# Altium project PS_WIKA.PrjPcb
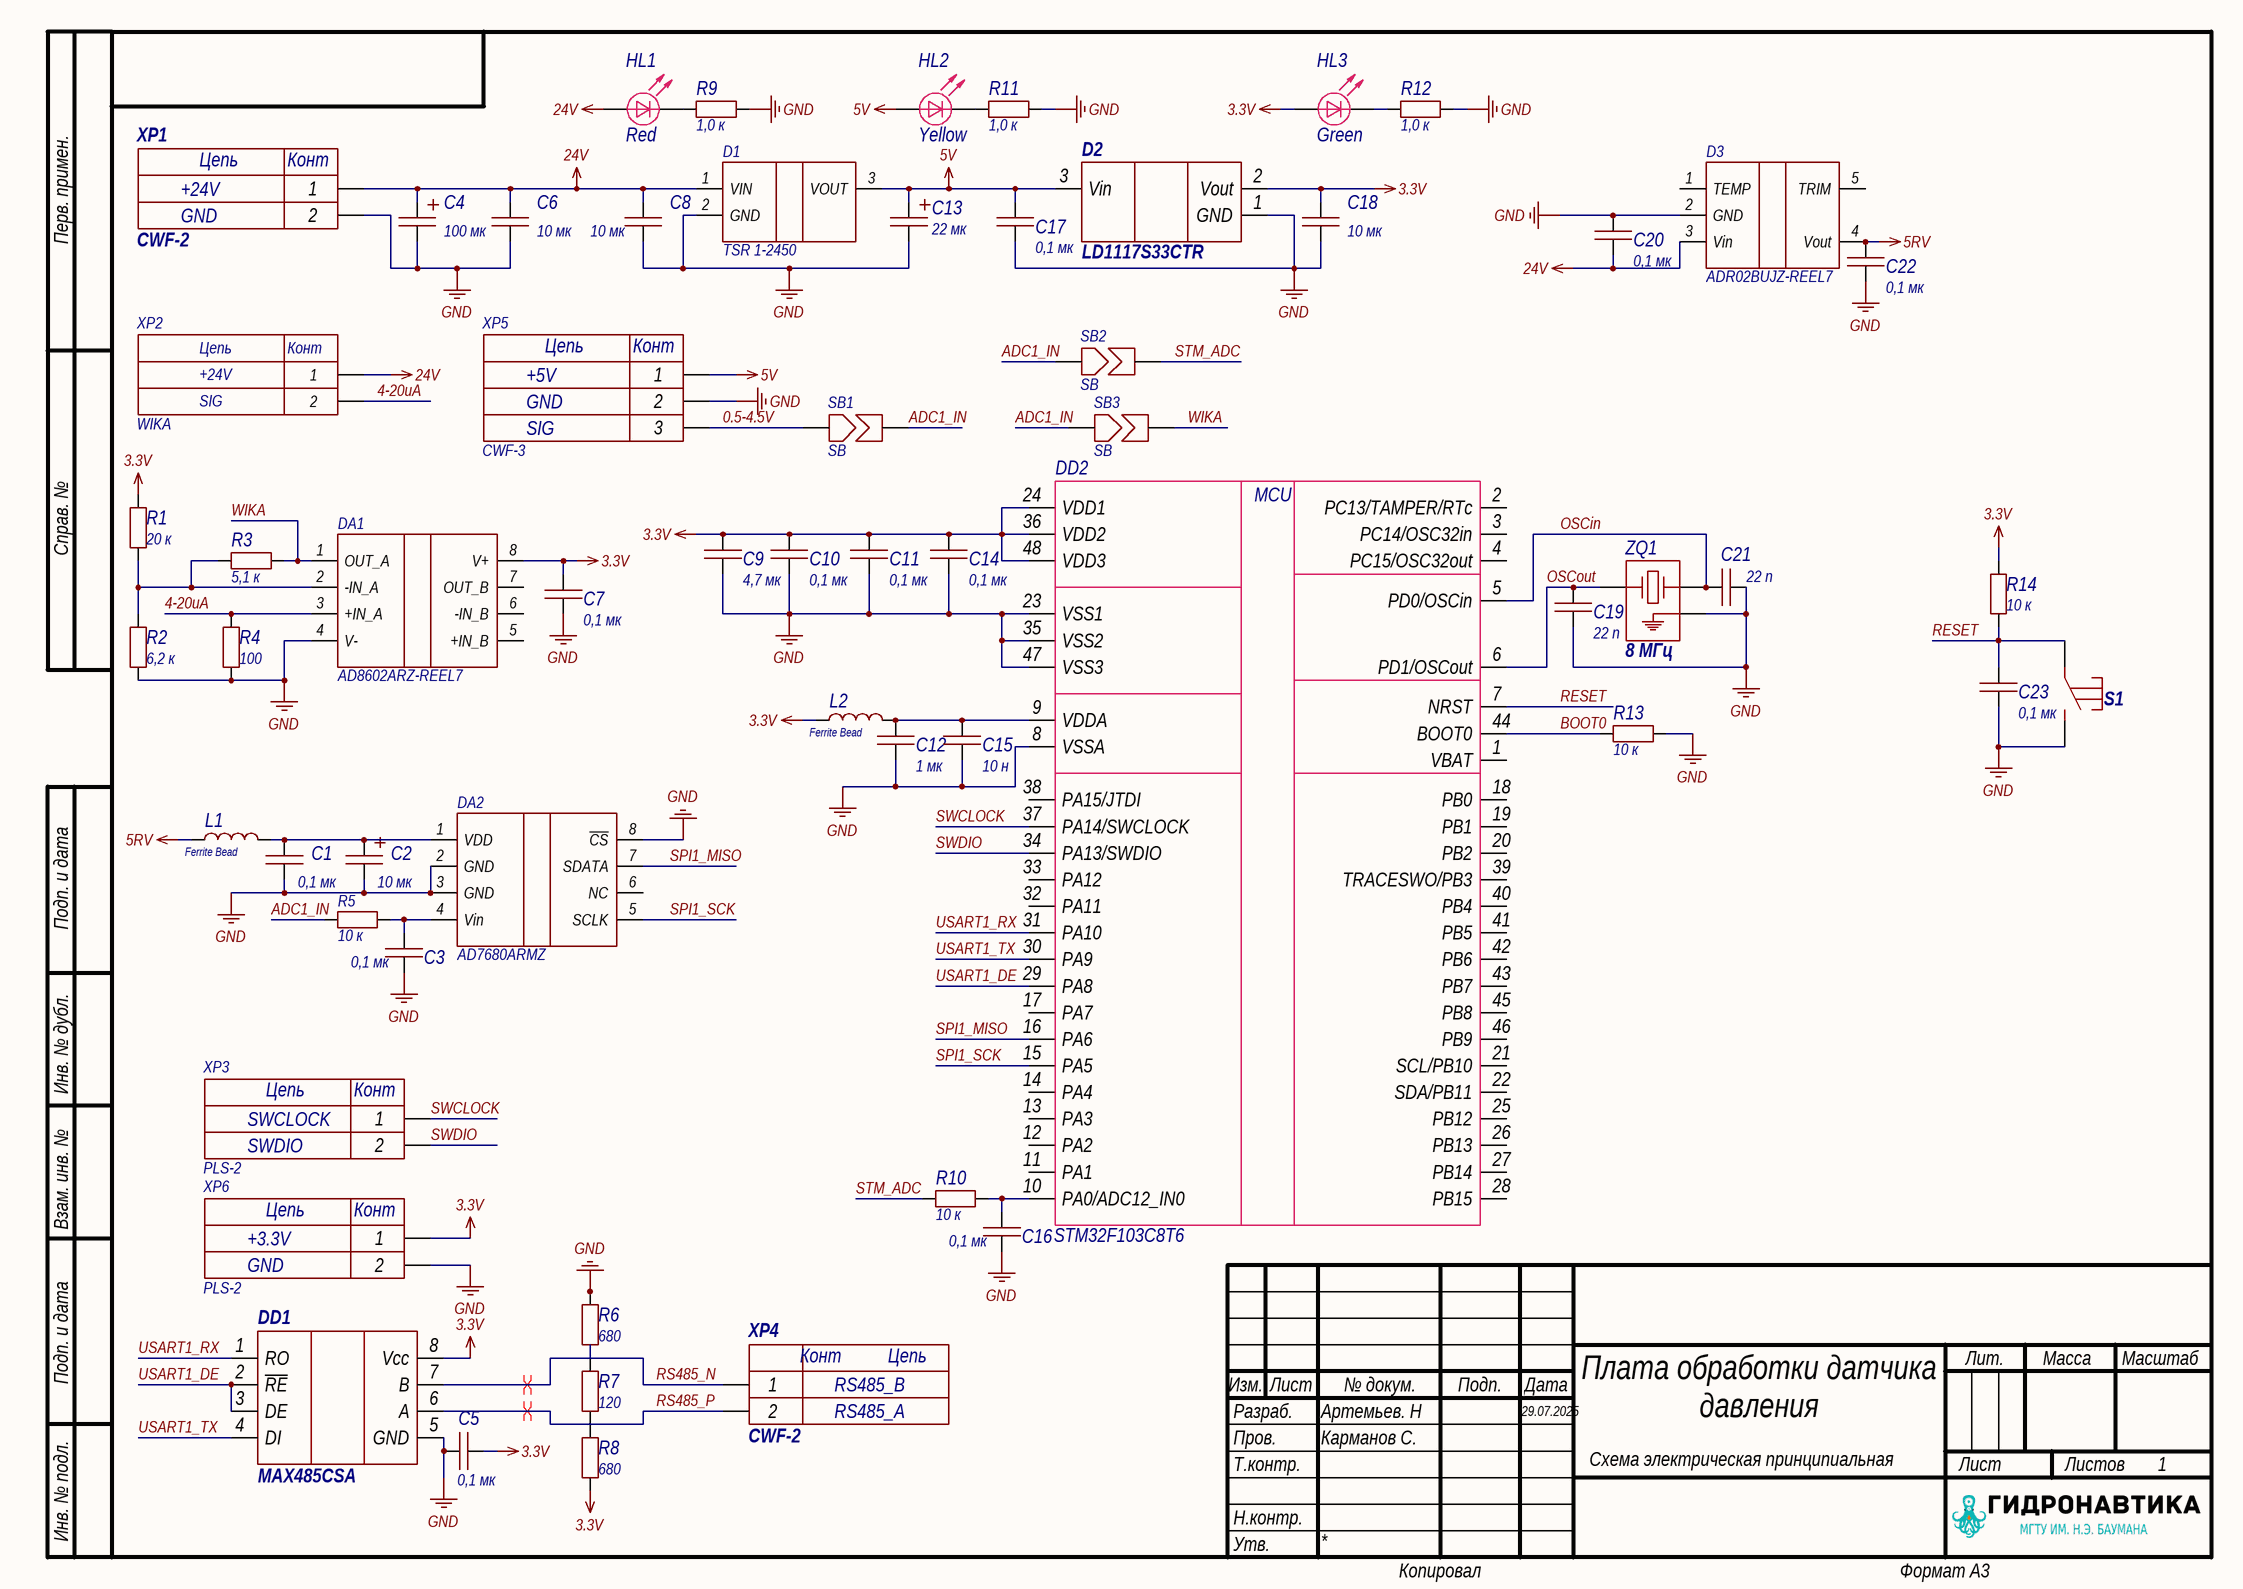
[diagram p0: Shema.SchDoc]
CheckedBy: Карманов С.; Decimal_Number_PCB: ГИДР.123456.008; Decimal_Number_Shematic: ГИДР.123456.009; DrawnBy: Артемьев. Н; Release_Date: 29.07.2025; Title: Плата обработки датчика давления; Version: 01
1 sheet, 60 parts. Net scope: global (net labels, ports and power ports of the same name join across sheets).
Board files: PCB1.PcbDoc, BOARD_34.PcbDoc

## Sheet Shema.SchDoc: Плата обработки датчика давления
size 420 x 297 mm; SheetTotal: 1

### Parts
C1  value 0,1 мк  [0603C]  (hidden comment: Capacitor)
C2  value 10 мк  [TC_A]  (hidden comment: Capacitor)
C3  value 0,1 мк  [0603C]  (hidden comment: Capacitor)
C4  value 100 мк  [TC_A]  (hidden comment: Capacitor)
C5  value 0,1 мк  [0603C]  (hidden comment: Capacitor)
C6  value 10 мк  [1210C]  (hidden comment: Capacitor)
C7  value 0,1 мк  [0603C]  (hidden comment: Capacitor)
C8  value 10 мк  [1210C]  (hidden comment: Capacitor)
C9  value 4,7 мк  [1206C]  (hidden comment: Capacitor)
C10  value 0,1 мк  [0603C]  (hidden comment: Capacitor)
C11  value 0,1 мк  [0603C]  (hidden comment: Capacitor)
C12  value 1 мк  [0603C]  (hidden comment: Capacitor)
C13  value 22 мк  [TC_A]  (hidden comment: Capacitor)
C14  value 0,1 мк  [0603C]  (hidden comment: Capacitor)
C15  value 10 н  [0603C]  (hidden comment: Capacitor)
C16  value 0,1 мк  [0603C]  (hidden comment: Capacitor)
C17  value 0,1 мк  [0603C]  (hidden comment: Capacitor)
C18  value 10 мк  [1210C]  (hidden comment: Capacitor)
C19  value 22 п  [0603C]  (hidden comment: Capacitor)
C20  value 0,1 мк  [0603C]  (hidden comment: Capacitor)
C21  value 22 п  [0603C]  (hidden comment: Capacitor)
C22  value 0,1 мк  [0603C]  (hidden comment: Capacitor)
C23  value 0,1 мк  [0603C]  (hidden comment: Capacitor)
D1  TSR 1-2450  [SIP3]
D2  LD1117S33CTR  [SOT223]
D3  ADR02BUJZ-REEL7  [SOT23-5]
DA1  AD8602ARZ-REEL7  [SOIC-8]
DA2  AD7680ARMZ  [MSOP-8]
DD1  MAX485CSA  [SOIC-8]
DD2  STM32F103C8T6  Value1: MCU  [LQFP48]
HL1  Color: Red  [0805D]  (hidden comment: LED)
HL2  Color: Yellow  [0805D]  (hidden comment: LED)
HL3  Color: Green  [0805D]  (hidden comment: LED)
L1  Ferrite Bead  [0603L]
L2  Ferrite Bead  [0603L]
R1  value 20 к  [0603R]  (hidden comment: Resistor)
R2  value 6,2 к  [0603R]  (hidden comment: Resistor)
R3  value 5,1 к  [0603R]  (hidden comment: Resistor)
R4  value 100  [0603R]  (hidden comment: Resistor)
R5  value 10 к  [0603R]  (hidden comment: Resistor)
R6  value 680  [0603R]  (hidden comment: Resistor)
R7  value 120  [1206R]  (hidden comment: Resistor)
R8  value 680  [0603R]  (hidden comment: Resistor)
R9  value 1,0 к  [0603R]  (hidden comment: Resistor)
R10  value 10 к  [0603R]  (hidden comment: Resistor)
R11  value 1,0 к  [0603R]  (hidden comment: Resistor)
R12  value 1,0 к  [0603R]  (hidden comment: Resistor)
R13  value 10 к  [0603R]  (hidden comment: Resistor)
R14  value 10 к  [0603R]  (hidden comment: Resistor)
S1  Tact_button  [Button_SMD_10mm]  (value not drawn)
SB1  SB  [0805SB]
SB2  SB  [0805SB]
SB3  SB  [0805SB]
XP1  CWF-2  Value2: GND  Value1: +24V  [CWF-2]
XP2  WIKA  [WIKA_PCB]
XP3  PLS-2  Value2: SWDIO  Value1: SWCLOCK  [PLS2]
XP4  CWF-2  Value2: RS485_A  Value1: RS485_B  [CWF-2]
XP5  CWF-3  Value3: SIG  Value2: GND  Value1: +5V  [CWF-3]
XP6  PLS-2  Value2: GND  Value1: +3.3V  [PLS2]
ZQ1  value 8 МГц  [QSMD3.2x2.5]  (hidden comment: XTAL_GND)

### Nets
3.3V: C5.2 C7.2 C9.2 C10.2 C11.2 C14.2 C18.2 D2.2(Vout) DA1.8(V+) DD1.8(Vcc) DD2.24(VDD1) DD2.36(VDD2) DD2.48(VDD3) HL3.1 L2.1 R1.2 R8.1 R14.1 XP6.1
5RV: C22.2 D3.4(Vout) L1.1
5V: C13.1 C17.2 D1.3(VOUT) D2.3(Vin) HL2.1 XP5.1
24V: C4.1 C6.2 C8.2 C20.1 D1.1(VIN) D3.3(Vin) HL1.1 XP1.1 XP2.1
GND: C1.1 C2.2 C3.1 C4.2 C5.1 C6.1 C7.1 C8.1 C9.1 C10.1 C11.1 C12.1 C13.2 C14.1 C15.1 C16.1 C17.1 C18.1 C19.2 C20.2 C21.1 C22.1 C23.2 D1.2(GND) D2.1(GND) D3.2(GND) DA1.4(V-) DA2.2(GND) DA2.3(GND) DA2.8(~{CS}) DD1.5(GND) DD2.8(VSSA) DD2.23(VSS1) DD2.35(VSS2) DD2.47(VSS3) R2.1 R4.2 R6.2 R9.2 R11.2 R12.2 R13.2 S1.2 XP1.2 XP5.2 XP6.2 ZQ1.3
0.5-4.5V: SB1.1 XP5.3
4-20uA: DA1.3(+IN_A) R4.1 XP2.2
ADC1_IN: R5.1 SB1.2 SB2.1 SB3.1
BOOT0: DD2.44(BOOT0) R13.1
OSCin: C21.2 DD2.5(PD0/OSCin) ZQ1.2
OSCout: C19.1 DD2.6(PD1/OSCout) ZQ1.1
RESET: C23.1 DD2.7(NRST) R14.2 S1.1
RS485_N: DD1.7(B) R6.1 R7.2 XP4.1
RS485_P: DD1.6(A) R7.1 R8.2 XP4.2
SPI1_MISO: DA2.7(SDATA) DD2.16(PA6)
SPI1_SCK: DA2.5(SCLK) DD2.15(PA5)
STM_ADC: R10.1 SB2.2
SWCLOCK: DD2.37(PA14/SWCLOCK) XP3.1
SWDIO: DD2.34(PA13/SWDIO) XP3.2
USART1_DE: DD1.2(~{RE}) DD1.3(DE) DD2.29(PA8)
USART1_RX: DD1.1(RO) DD2.31(PA10)
USART1_TX: DD1.4(DI) DD2.30(PA9)
WIKA: DA1.1(OUT_A) R3.2 SB3.2
NetC1_2: C1.2 C2.1 DA2.1(VDD) L1.2
NetC3_2: C3.2 DA2.4(Vin) R5.2
NetC12_2: C12.2 C15.2 DD2.9(VDDA) L2.2
NetC16_2: C16.2 DD2.10(PA0/ADC12_IN0) R10.2
NetDA1_2: DA1.2(-IN_A) R1.1 R2.2 R3.1
NetHL1_2: HL1.2 R9.1
NetHL2_2: HL2.2 R11.1
NetHL3_2: HL3.2 R12.1

Not connected (* = marked no-connect by the designer): D3 1(TEMP) 5(TRIM); DA1 5(+IN_B) 6(-IN_B) 7(OUT_B); DA2 6(NC); DD2 1(VBAT) 2(PC13/TAMPER/RTc) 3(PC14/OSC32in) 4(PC15/OSC32out) 11(PA1) 12(PA2) 13(PA3) 14(PA4) 17(PA7) 18(PB0) 19(PB1) 20(PB2) 21(SCL/PB10) 22(SDA/PB11) 25(PB12) 26(PB13) 27(PB14) 28(PB15) 32(PA11) 33(PA12) 38(PA15/JTDI) 39(TRACESWO/PB3) 40(PB4) 41(PB5) 42(PB6) 43(PB7) 45(PB8) 46(PB9)

### Layout directives
differential pair: RS485_N, RS485_P

### Notes on the sheet
- Перв. примен.
- Справ. №
- Подп. и дата
- Инв. № дубл.
- Взам. инв. №
- Разраб.
- Изм.
- Лист
- № докум.
- Подп.
- Дата
- Лит.
- Масса
- Масштаб
- Пров.
- Т.контр.
- Схема электрическая принципиальная
- Листов
- Инв. № подл.
- Утв.
- Н.контр.
- Копировал
- Формат А3
- (in symbol CWF-2) Цепь; Конт
- (in symbol CWF-3) Цепь; Конт
- (in symbol PLS-2) Цепь; Конт
- (in symbol WIKA) Цепь; Конт; +24V; SIG

### Library data of the parts
C1 C3 C5 C7 C10 C11 C14 C16 C17 C20 C22 C23 = Capacitor_0,1u_10_50V_X7R_0603C: Конденсатор; Library Path2: Schematic\Capacitor.SchLib; Tolerance: 0,1; Voltage (V): 50; Dielectric: X7R; Capacity (nF): 100; Part Number: Capacitor_0,1u_10_50V_X7R_0603C
C2 = Capacitor_10u_10_50V_TC_A: Танталовый конденсатор; Tolerance: 0,1; Voltage (V): 50; Type: Tantalum; Capacity (uF): 10; Part Number: Capacitor_10u_10_50V_TC_A
C4 = Capacitor_100u_10_50V_TC_A: Танталовый конденсатор; Tolerance: 0,1; Voltage (V): 50; Type: Tantalum; Capacity (uF): 100; Part Number: Capacitor_100u_10_50V_TC_A
C6 C8 C18 = Capacitor_10u_10_35V_X7R_1210C: Конденсатор; Library Path2: Schematic\Capacitor.SchLib; Tolerance: 0,1; Voltage (V): 35; Dielectric: X7R; Capacity (nF): 10000; Part Number: Capacitor_10u_10_35V_X7R_1210C
C9 = Capacitor_4,7u_10_50V_X7R_1206C: Конденсатор; Library Path2: Schematic\Capacitor.SchLib; Tolerance: 0,1; Voltage (V): 50; Dielectric: X7R; Capacity (nF): 4700; Part Number: Capacitor_4,7u_10_50V_X7R_1206C
C12 = Capacitor_1u_10_50V_X7R_0603C: Конденсатор; Library Path2: Schematic\Capacitor.SchLib; Tolerance: 0,1; Voltage (V): 50; Dielectric: X7R; Capacity (nF): 1000; Part Number: Capacitor_1u_10_50V_X7R_0603C
C13 = Capacitor_22u_10_50V_TC_A: Танталовый конденсатор; Tolerance: 0,1; Voltage (V): 50; Type: Tantalum; Capacity (uF): 22; Part Number: Capacitor_22u_10_50V_TC_A
C15 = Capacitor_10n_10_50V_X7R_0603C: Конденсатор; Library Path2: Schematic\Capacitor.SchLib; Tolerance: 0,1; Voltage (V): 50; Dielectric: X7R; Capacity (nF): 10; Part Number: Capacitor_10n_10_50V_X7R_0603C
C19 C21 = Capacitor_22p_5_50V_X7R_0603C: Конденсатор; Library Path2: Schematic\Capacitor.SchLib; Tolerance: 0,05; Voltage (V): 50; Dielectric: X7R; Capacity (nF): 0,022; Part Number: Capacitor_22p_5_50V_X7R_0603C
D1 = TSR 1-2450: DC/DC преобразователь, 5Вт, вход 6.5-36В, выход 5В/ 1А; Part Number: TSR 1-2450
D2 = LD1117S33CTR: Линейный стабилизатор напряжения; Part Number: LD1117S33CTR
D3 = ADR02BUJZ-REEL7: Источник опорного напряжения, 5 В; Part Number: ADR02BUJZ-REEL7
DA1 = AD8602ARZ-REEL7: 2-х канальный прецизионный, широкополосный операционный усилитель с однополярным питанием; Part Number: AD8602ARZ-REEL7
DA2 = AD7680ARMZ: 16-бит АЦП, SAR, 100Квыборок/с; Part Number: AD7680ARMZ
DD1 = MAX485CSA: RS-485 приёмопередатчик; Part Number: MAX485CSA
DD2 = STM32F103C8T6: Микроконтроллер; Manufacturer: ST Microelectronics; Rate: -0,3...4,0В; Shop: магазин с самой дешевой ценой; Notice: 48 пиновая версия STM32F103; Datasheet: http://www.st.com/content/ccc/resource/technical/document/datasheet/33/d4/6f/1d/df/0b/4c/6d/CD00161566.pdf/files/CD00161566.pdf/jcr:content/translations/en.CD00161566.pdf; Case: корпус; Part Number: STM32F103C8T6
HL1-HL3 = LED: Светодиод; Part Number: LED
L1 L2 = Inductance: BLM18AG121SZ1D Ferrite Beads Multi-Layer 120Ohm 25% 100MHz 0.8A 0.18Ohm DCR 0603 Automotive T/R Бусина ферритовая чип, габарит 0603, импеданс 120R, максимальный постоянный ток 800MA, активное сопротивление 0R18; Part Number: Inductance
R1 = Resistor_20k_1_0603: Резистор номиналом 20 кОм и точностью 1%; Power: *; Part Number: Resistor_20k_1_0603; Tolerance: 1%
R2 = Resistor_6.2k_1_0603: Резистор номиналом 6,2 кОм и точностью 1%; Power: *; Part Number: Resistor_6.2k_1_0603; Tolerance: 1%
R3 = Resistor_5.1k_1_0603: Резистор номиналом 5,1 кОм и точностью 1%; Power: *; Part Number: Resistor_5.1k_1_0603; Tolerance: 1%
R4 = Resistor_100_1_0603: Резистор номиналом 100 Ом и точностью 1%; Power: *; Part Number: Resistor_100_1_0603; Tolerance: 1%
R5 R10 R13 R14 = Resistor_10k_1_0603: Резистор номиналом 10 кОм и точностью 1%; Power: *; Part Number: Resistor_10k_1_0603; Tolerance: 1%
R6 R8 = Resistor_680_1_0603: Резистор номиналом 680 Ом и точностью 1%; Power: *; Part Number: Resistor_680_1_0603; Tolerance: 1%
R7 = Resistor_120_1_0603: Резистор номиналом 120 Ом и точностью 1%; Power: *; Part Number: Resistor_120_1_0603; Tolerance: 1%
R9 R11 R12 = Resistor_1.0k_1_0603: Резистор номиналом 1,0 кОм и точностью 1%; Power: *; Part Number: Resistor_1.0k_1_0603; Tolerance: 1%
S1 = Tact_button: Тактовая кнопка; Part Number: Tact_button
SB1-SB3 = SB: Solder bridge, мост припоя, запаиваемая перемычка, net tie, jumper; Part Number: SB
XP1 XP4 = CWF-2: 2-пиновый разъем с ключом; System: Connector; Part Number: CWF-2; Datasheet: https://static.chipdip.ru/lib/413/DOC001413777.pdf
XP3 XP6 = PLS-2: Гребенка 2 пина; System: Connector; Part Number: PLS-2
XP5 = CWF-3: 3-пиновый разъем с ключом; System: Connector; Part Number: CWF-3
ZQ1 = XTAL_GND: Кварцевый резонатор с входом земли; Part Number: XTAL_GND
XP2 = WIKA: Part Number: WIKA

## Assembly variants
01: not fitted SB1 SB2